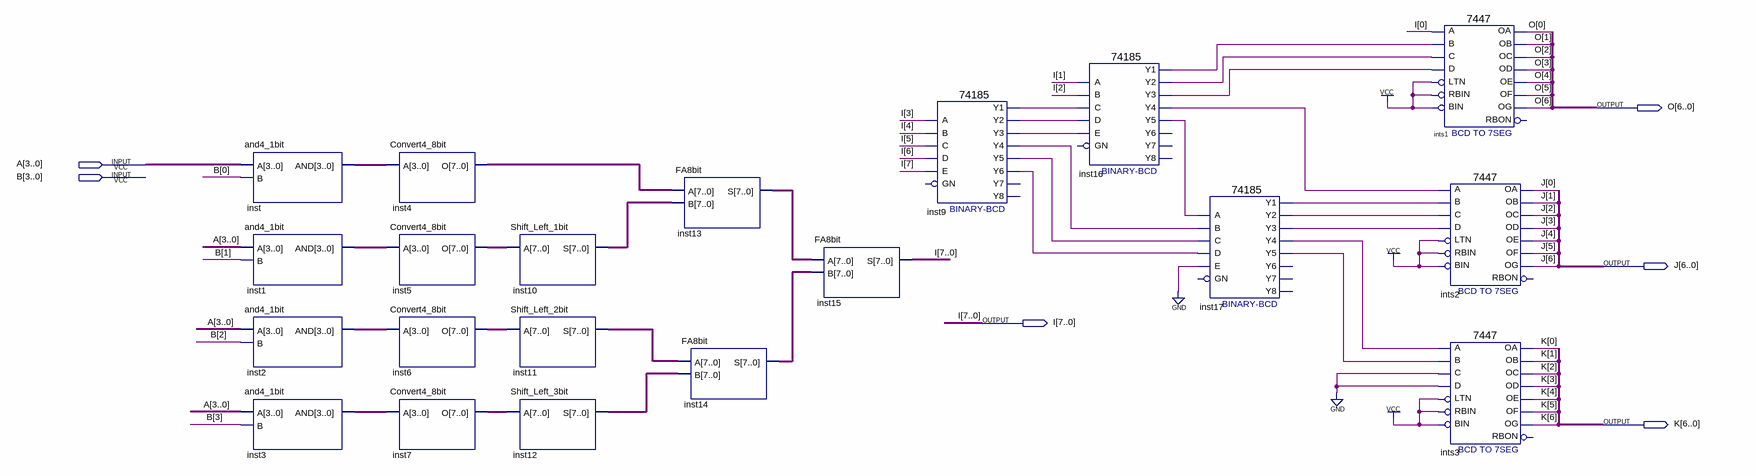
[diagram p0: schematic sheet]
// Quartus schematic MUL_4bit.bdf as structural Verilog: 20 symbols, 6 pins
module MUL_4bit (
  input  [3:0] A,
  input  [3:0] B,
  output [6:0] O,
  output [6:0] J,
  output [7:0] I,
  output [6:0] K
);

  wire inst9_y1, inst9_y2, inst9_y3, inst9_y4, inst9_y5, inst9_y6, inst16_y1, inst16_y2, inst16_y3,
       inst16_y4, inst16_y5, inst17_y1, inst17_y2, inst17_y3, inst17_y4, inst17_y5;
  wire [3:0] inst1_and, inst2_and, inst3_and, inst_and;
  wire [7:0] inst4_o, inst5_o, inst6_o, inst7_o, inst10_s, inst11_s, inst12_s, inst13_s, inst14_s;

  and4_1bit inst (.A(A), .B(B[0]), .AND(inst_and));
  and4_1bit inst1 (.A(A), .B(B[1]), .AND(inst1_and));
  and4_1bit inst2 (.A(A), .B(B[2]), .AND(inst2_and));
  and4_1bit inst3 (.A(A), .B(B[3]), .AND(inst3_and));
  Convert4_8bit inst4 (.A(inst_and), .O(inst4_o));
  Convert4_8bit inst5 (.A(inst1_and), .O(inst5_o));
  Convert4_8bit inst6 (.A(inst2_and), .O(inst6_o));
  Convert4_8bit inst7 (.A(inst3_and), .O(inst7_o));
  Shift_Left_1bit inst10 (.A(inst5_o), .S(inst10_s));
  Shift_Left_2bit inst11 (.A(inst6_o), .S(inst11_s));
  Shift_Left_3bit inst12 (.A(inst7_o), .S(inst12_s));
  FA8bit inst13 (.A(inst4_o), .B(inst10_s), .S(inst13_s));
  FA8bit inst14 (.A(inst11_s), .B(inst12_s), .S(inst14_s));
  FA8bit inst15 (.A(inst13_s), .B(inst14_s), .S(I));
  \74185  inst9 (
    .A(I[3]), .B(I[4]), .D(I[6]), .C(I[5]), .E(I[7]), .Y1(inst9_y1), .Y3(inst9_y3), .Y2(inst9_y2),
    .Y5(inst9_y5), .Y4(inst9_y4), .Y6(inst9_y6));  // open: GN, Y8, Y7
  \74185  inst16 (
    .A(I[1]), .B(I[2]), .D(inst9_y2), .C(inst9_y1), .E(inst9_y3), .Y1(inst16_y1), .Y3(inst16_y3),
    .Y2(inst16_y2), .Y5(inst16_y5), .Y4(inst16_y4));  // open: GN, Y6, Y8, Y7
  \74185  inst17 (
    .A(inst16_y5), .B(inst9_y4), .D(inst9_y6), .C(inst9_y5), .E(1'b0), .Y1(inst17_y1), .Y3(inst17_y3),
    .Y2(inst17_y2), .Y5(inst17_y5), .Y4(inst17_y4));  // open: GN, Y6, Y8, Y7
  \7447  ints1 (
    .LTN(1'b1), .B(inst16_y1), .C(inst16_y2), .D(inst16_y3), .RBIN(1'b1), .BIN(1'b1), .A(I[0]), .OB(O[1]),
    .OC(O[2]), .OE(O[4]), .OD(O[3]), .OF(O[5]), .OG(O[6]), .OA(O[0]));  // open: RBON
  \7447  ints2 (
    .LTN(1'b1), .B(inst17_y1), .C(inst17_y2), .D(inst17_y3), .RBIN(1'b1), .BIN(1'b1), .A(inst16_y4),
    .OB(J[1]), .OC(J[2]), .OE(J[4]), .OD(J[3]), .OF(J[5]), .OG(J[6]), .OA(J[0]));  // open: RBON
  \7447  ints3 (
    .LTN(1'b1), .B(inst17_y5), .C(1'b0), .D(1'b0), .RBIN(1'b1), .BIN(1'b1), .A(inst17_y4), .OB(K[1]),
    .OC(K[2]), .OE(K[4]), .OD(K[3]), .OF(K[5]), .OG(K[6]), .OA(K[0]));  // open: RBON
endmodule
